# EAGLE schematic daughter-double (EAGLE 6.6.0)
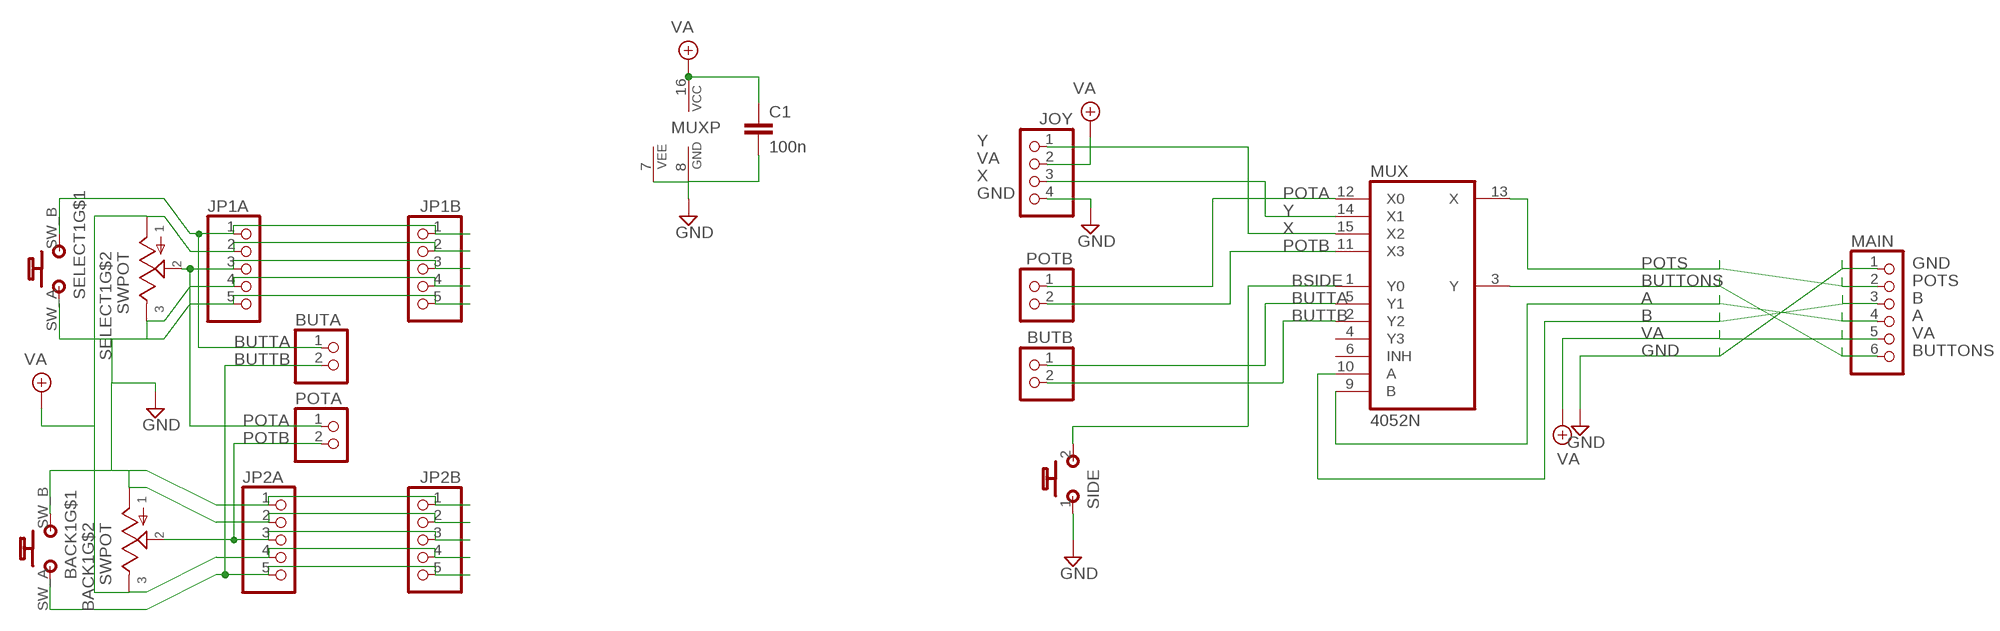
[diagram p0: schematic, sheet 1]

## Parts
BACK1  SWPOT  [SWPOT]
BUTA  PINHD-1X2  [1X02]
BUTB  PINHD-1X2  [1X02]
C1  100n  050X030_050  [050X030_050_3]
JOY  PINHD-1X4  [1X04]
JP1A  PINHD-1X5  [1X05]
JP1B  PINHD-1X5  [1X05]
JP2A  PINHD-1X5  [1X05]
JP2B  PINHD-1X5  [1X05]
MAIN  PINHD-1X6  [1X06]
MUX  4052N  [DIL16]
POTA  PINHD-1X2  [1X02]
POTB  PINHD-1X2  [1X02]
SELECT1  SWPOT  [SWPOT]
SIDE  MOMENTARY  [SPST2]

## Nets
A: MAIN.4 MUX.9(B)
B: MAIN.3 MUX.10(A)
BSIDE: MUX.1(Y0) SIDE.2(S)
BUTTA: BUTA.1 BUTB.1 JP1A.1 JP1B.1 MUX.5(Y1) SELECT1.SW_B(B_B)
BUTTB: BACK1.SW_A(B_A) BUTA.2 BUTB.2 JP2A.5 JP2B.5 MUX.2(Y2)
BUTTONS: MAIN.6 MUX.3(Y)
GND: BACK1.POT_B BACK1.SW_B(B_B) C1.2 JOY.4 JP1A.4 JP1A.5 JP1B.4 JP1B.5 JP2A.1 JP2A.2 JP2B.1 JP2B.2 MAIN.1 MUX.7(VEE) MUX.8(GND) SELECT1.POT_A SELECT1.SW_A(B_A) SIDE.1(P)
POTA: JP1A.3 JP1B.3 MUX.12(X0) POTA.1 POTB.1 SELECT1.POT_W
POTB: BACK1.POT_W JP2A.3 JP2B.3 MUX.11(X3) POTA.2 POTB.2
POTS: MAIN.2 MUX.13(X)
VA: BACK1.POT_A C1.1 JOY.2 JP1A.2 JP1B.2 JP2A.4 JP2B.4 MAIN.5 MUX.16(VCC) SELECT1.POT_B
X: JOY.1 MUX.15(X2)
Y: JOY.3 MUX.14(X1)
Unconnected: MUX.4(Y3) MUX.6(INH)

## Library data of the parts
BACK1 SELECT1 = jaapie:SWPOT
BUTA BUTB POTA POTB = pinhead:PINHD-1X2: PIN HEADER
C1 = gm-caps-ceramic:050X030_050: 120 - 150pF Xicon Ceramic Disc 5mm lead spacing
JOY = pinhead:PINHD-1X4: PIN HEADER
JP1A JP1B JP2A JP2B = pinhead:PINHD-1X5: PIN HEADER
MAIN = pinhead:PINHD-1X6: PIN HEADER
MUX = 40xx:4052: Dual 4-channel ANALOG MULTIPLEXER
SIDE = gm-switches:MOMENTARY